# Altium schematic sheet Schematic_Altium.schdoc
size 270 x 150 mm
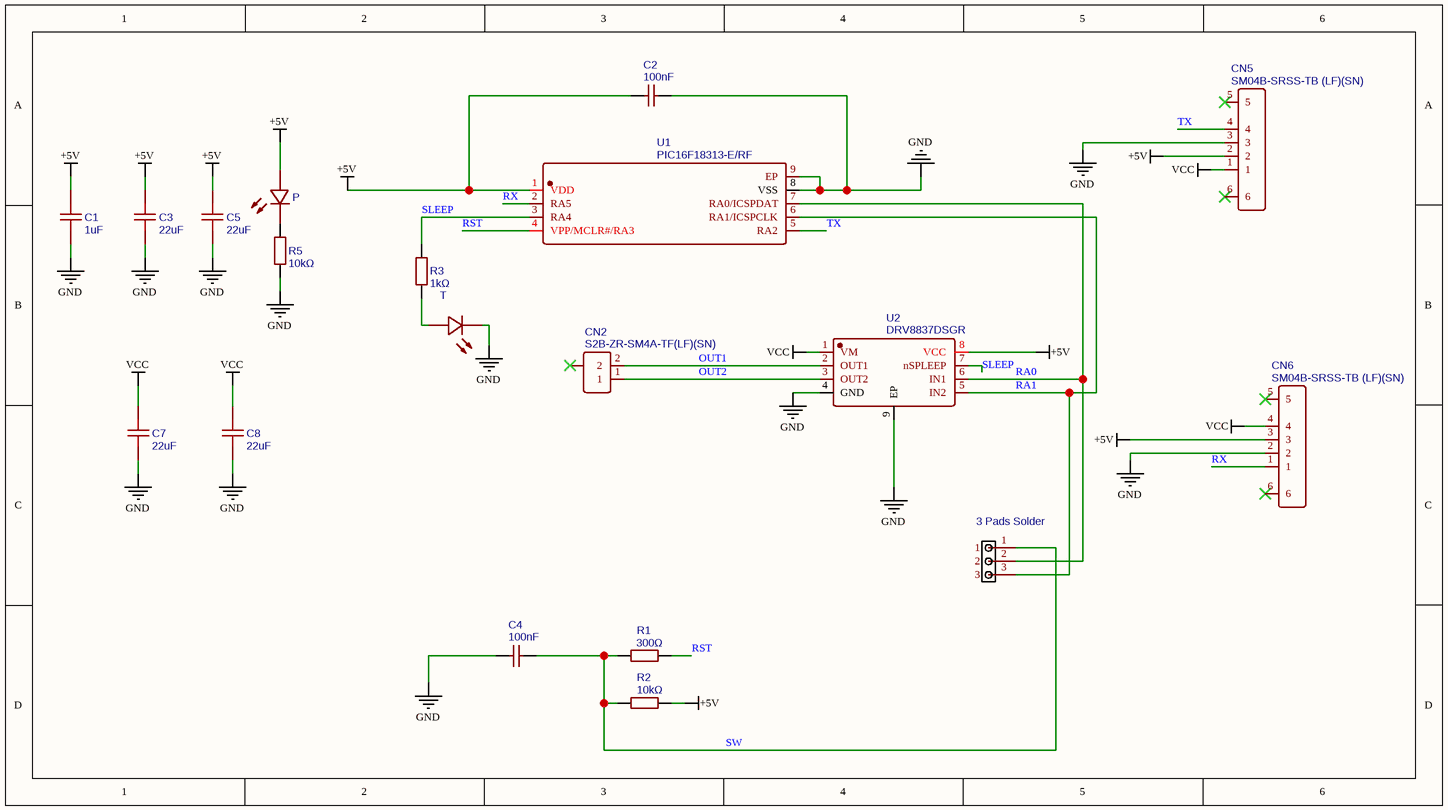
[diagram p0: Schematic_Altium.schdoc]

## Parts
C1  1uF  [C0402]
C2  100nF  [C0402_NEW]
C3  22uF  [C0402]
C4  100nF  [C0402_NEW]
C5  22uF  [C0402]
C7  22uF  [C0402]
C8  22uF  [C0402]
CN2  S2B-ZR-SM4A-TF(LF)(SN)  [CONN-SMD_S2B-ZR-SM4A]
CN3  3 Pads Solder  [3PADS-JED]
CN5  SM04B-SRSS-TB (LF)(SN)  [CONN-SMD_4P-P1.00_SM04B-SRSS-TB-LF-SN]
CN6  SM04B-SRSS-TB (LF)(SN)  [CONN-SMD_4P-P1.00_SM04B-SRSS-TB-LF-SN]
P  19-213/GVC-CK0LLY/3T(HW)  [LED0603-R-RD]  (value not drawn)
R1  300Ω  [R0402]
R2  10kΩ  [R0402]
R3  1kΩ  [R0402]
R5  10kΩ  [R0402]
T  19-213/GVC-CK0LLY/3T(HW)  [LED0603-R-RD]  (value not drawn)
U1  PIC16F18313-E/RF  [DFN-8_L3.0-W3.0-P0.65-BL-EP]
U2  DRV8837DSGR  [WSON-8_L2.0-W2.0-P0.50-TL-EP]

## Nets
+5V: C1.2 C2.1 C3.2 C5.2 CN5.2 CN6.3 P.1(A) R2.2 U1.1(VDD) U2.8(VCC)
GND: C1.1 C2.2 C3.1 C4.1 C5.1 C7.1 C8.1 CN5.3 CN6.2 R5.1 T.2(K) U1.8(VSS) U1.9(EP) U2.4(GND) U2.9(EP)
VCC: C7.2 C8.2 CN5.1 CN6.4 U2.1(VM)
OUT1: CN2.2 U2.2(OUT1)
OUT2: CN2.1 U2.3(OUT2)
RA0: CN3.2 U1.7(RA0/ICSPDAT) U2.6(IN1)
RA1: CN3.3 U1.6(RA1/ICSPCLK) U2.5(IN2)
RST: R1.2 U1.4(VPP/MCLR#/RA3)
RX: CN6.1 U1.2(RA5)
SLEEP: R3.1 U1.3(RA4) U2.7(nSPLEEP)
SW: C4.2 CN3.1 R1.1 R2.1
TX: CN5.4 U1.5(RA2)
NetP_2: P.2(K) R5.2
NetR3_2: R3.2 T.1(A)

Not connected (* = marked no-connect by the designer): CN2 0*; CN5 5* 6*; CN6 5* 6*

## Library data of the parts
C1 = 1uF: Manufacturer: SAMSUNG(三星); Manufacturer Part: CL05A105KA5NQNC; nameAlias: Capacitance; Supplier: LCSC; Supplier Part: C52923; JLCPCB Part Class: Basic Part; spicePre: C; spiceSymbolName: CL05A105KA5NQNC
C2 C4 = 100nF: Manufacturer Part: CL05B104KO5NNNC; Manufacturer: SAMSUNG(三星); nameAlias: Capacitance; Supplier: LCSC; Supplier Part: C1525; JLCPCB Part Class: Basic Part; spicePre: C; spiceSymbolName: CL05B104KO5NNNC
C3 C5 C7 C8 = 22uF: Manufacturer: muRata(村田); Manufacturer Part: GRM155C80E226ME11D; nameAlias: Capacitance; Contributor: LCSC; Supplier: LCSC; Supplier Part: C907955; JLCPCB Part Class: Extended Part; spicePre: C; spiceSymbolName: GRM155R60J226ME11D
CN2 = S2B-ZR-SM4A-TF(LF)(SN): Manufacturer: JST; Contributor: LCSC; Supplier: LCSC; Supplier Part: C265329; Manufacturer Part: S2B-ZR-SM4A-TF(LF)(SN); JLCPCB Part Class: Extended Part; spicePre: C; spiceSymbolName: S2B-ZR-SM4A-TF(LF)(SN)
CN3 = 3 Pads Solder: Manufacturer Part: 3 pads; Contributor: JonnyED; spicePre: C; spiceSymbolName: 3 Pads Solder
CN5 CN6 = SM04B-SRSS-TB (LF)(SN): Manufacturer: JST; Contributor: LCSC; Supplier: LCSC; Supplier Part: C160404; Manufacturer Part: SM04B-SRSS-TB(LF)(SN); JLCPCB Part Class: Extended Part; spicePre: C; spiceSymbolName: SM04B-SRSS-TB (LF)(SN)
P T = 19-213/GVC-CK0LLY/3T(HW): Manufacturer: Everlight Elec; Contributor: LCSC; Supplier: LCSC; Supplier Part: C264453; Manufacturer Part: 19-213/GVC-CK0LLY/3T(HW); JLCPCB Part Class: Extended Part; spicePre: L; spiceSymbolName: 19-213/GVC-CK0LLY/3T(HW)
R1 = 300Ω: Manufacturer: UNI-ROYAL(厚声); Manufacturer Part: 0402WGF3000TCE; nameAlias: Resistance; Resistance (Ohms): 300; Supplier: LCSC; Supplier Part: C25102; JLCPCB Part Class: Basic Part; spicePre: R; spiceSymbolName: 0402WGF3000TCE
R2 R5 = 10kΩ: Manufacturer: UNI-ROYAL(厚声); Manufacturer Part: 0402WGF1002TCE; nameAlias: Resistance; Resistance (Ohms): 10K; Supplier: LCSC; Supplier Part: C25744; JLCPCB Part Class: Basic Part; spicePre: R; spiceSymbolName: 0402WGF1002TCE
R3 = 1kΩ: Manufacturer: UNI-ROYAL(厚声); Manufacturer Part: 0402WGF1001TCE; nameAlias: Resistance; Resistance (Ohms): 1K; Supplier: LCSC; Supplier Part: C11702; JLCPCB Part Class: Basic Part; spicePre: R; spiceSymbolName: 0402WGF1001TCE
U1 = PIC16F18313-E/RF: Manufacturer: MICROCHIP(美国微芯); Contributor: lcsc; Supplier: LCSC; Supplier Part: C635328; Manufacturer Part: PIC16F18313-E/RF; link: https://atta.szlcsc.comnull; spicePre: U; spiceSymbolName: PIC16F18313-E/RF
U2 = DRV8837DSGR: Manufacturer: TI(德州仪器); Supplier: LCSC; Manufacturer Part: DRV8837DSGR; Supplier Part: C39159; JLCPCB Part Class: Extended Part; spicePre: U; spiceSymbolName: DRV8837DSGR